# EAGLE schematic PCBschematicVoltage (EAGLE 9.5.1)
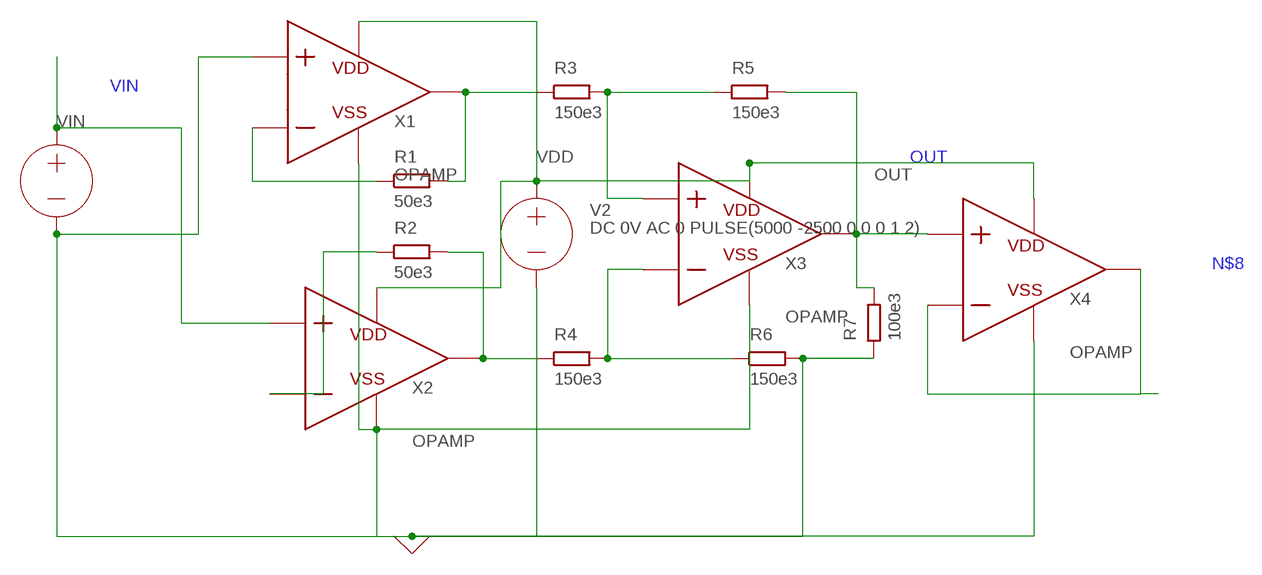
[diagram p0: schematic, sheet 1]

## Parts
R1  50e3  R  (no package)
R2  50e3  R  (no package)
R3  150e3  R  (no package)
R4  150e3  R  (no package)
R5  150e3  R  (no package)
R6  150e3  R  (no package)
R7  100e3  R  (no package)
V1  DC 5000 AC 5000 PULSE(5000 0 0 0 0 .5 1)  VOLTAGE  (no package)
V2  DC 0V AC 0 PULSE(5000 -2500 0 0 0 1 2)  VOLTAGE  (no package)
X1  OPAMP  (no package)
X2  OPAMP  (no package)
X3  OPAMP  (no package)
X4  OPAMP  (no package)

## Nets
0: R6.2 R7.1 V1.- V2.- X1.P X1.VSS X2.VSS X3.VSS X4.VSS ; supply symbol labelled GND
N$1: R1.1 X1.N
N$2: R1.2 R3.1 X1.VOUT
N$3: R3.2 R5.1 X3.P
N$5: R2.1 X2.N
N$6: R2.2 R4.1 X2.VOUT
N$7: R4.2 R6.1 X3.N
N$8: X4.N X4.VOUT
OUT: R5.2 R7.2 X3.VOUT X4.P
VDD: V2.+ X1.VDD X2.VDD X3.VDD X4.VDD
VIN: V1.+ X2.P

## Library data of the parts
R1-R7 = ngspice-simulation:R: RESISTOR
V1 V2 = ngspice-simulation:VOLTAGE: Independent Voltage Source, either DC, AC, PULSE, SINE, PWL, EXP, or SFFM; VALUE: 0V
X1-X4 = ngspice-simulation:OPAMP: Operational amplifier with power pins